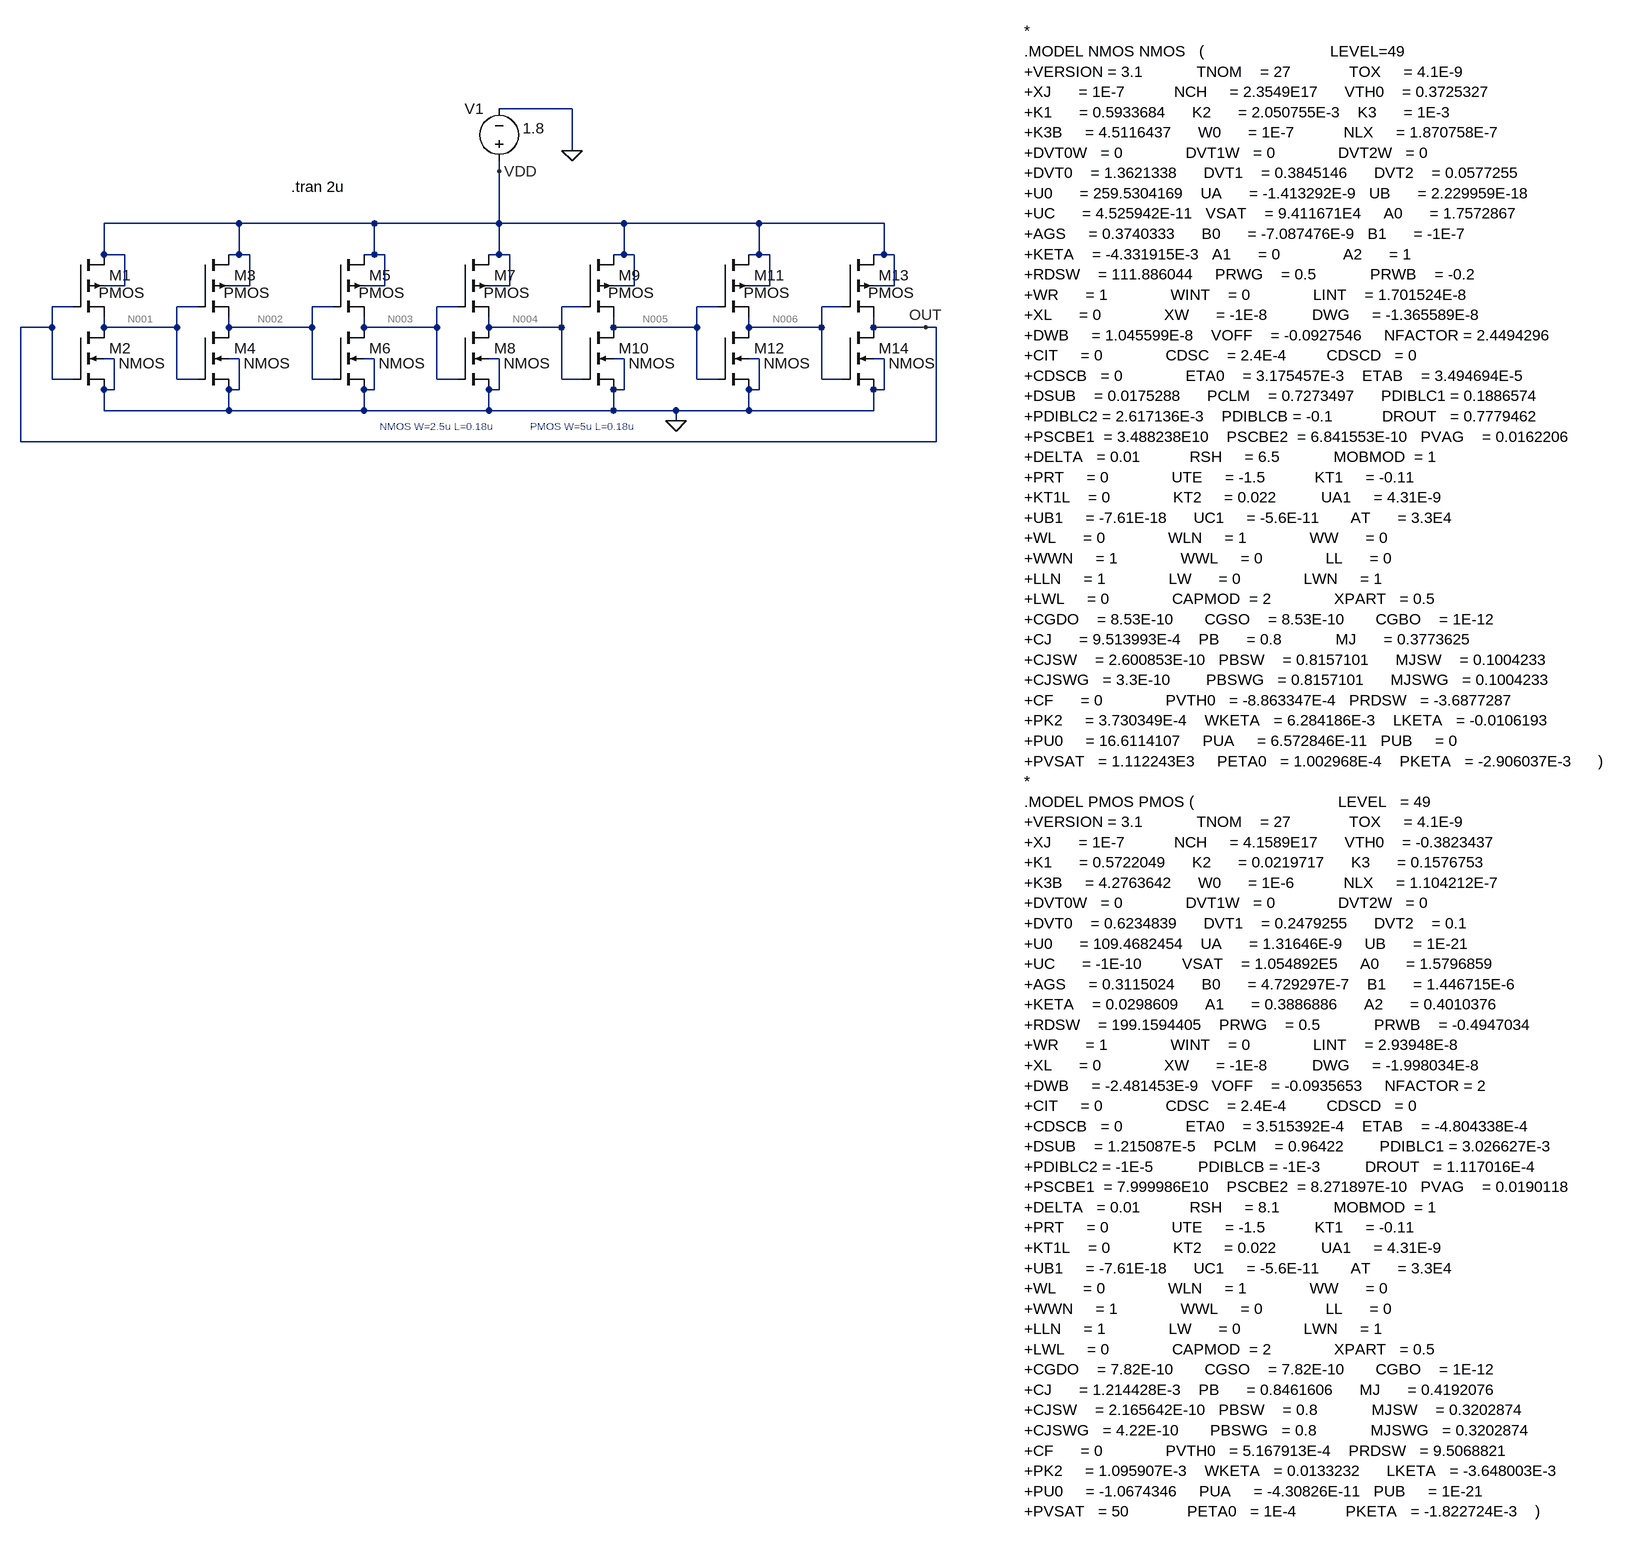
[diagram p0: schematic EXP3.asc]
EXP3.asc, the LTspice schematic file:
Version 4
SHEET 1 2600 1700
WIRE 960 -240 848 -240
WIRE 960 -176 960 -240
WIRE 848 -144 848 -160
WIRE 448 -64 240 -64
WIRE 656 -64 448 -64
WIRE 848 -64 848 -144
WIRE 848 -64 656 -64
WIRE 1040 -64 848 -64
WIRE 1248 -64 1040 -64
WIRE 1440 -64 1248 -64
WIRE 240 -16 240 -64
WIRE 272 -16 240 -16
WIRE 448 -16 448 -64
WIRE 448 -16 432 -16
WIRE 464 -16 448 -16
WIRE 656 -16 656 -64
WIRE 656 -16 640 -16
WIRE 672 -16 656 -16
WIRE 848 -16 848 -64
WIRE 848 -16 832 -16
WIRE 864 -16 848 -16
WIRE 1040 -16 1040 -64
WIRE 1040 -16 1024 -16
WIRE 1056 -16 1040 -16
WIRE 1248 -16 1248 -64
WIRE 1248 -16 1232 -16
WIRE 1264 -16 1248 -16
WIRE 1440 -16 1440 -64
WIRE 1440 -16 1424 -16
WIRE 1456 -16 1440 -16
WIRE 272 32 272 -16
WIRE 272 32 240 32
WIRE 464 32 464 -16
WIRE 464 32 432 32
WIRE 672 32 672 -16
WIRE 672 32 640 32
WIRE 864 32 864 -16
WIRE 864 32 832 32
WIRE 1056 32 1056 -16
WIRE 1056 32 1024 32
WIRE 1264 32 1264 -16
WIRE 1264 32 1232 32
WIRE 1456 32 1456 -16
WIRE 1456 32 1424 32
WIRE 192 64 160 64
WIRE 384 64 352 64
WIRE 592 64 560 64
WIRE 784 64 752 64
WIRE 976 64 944 64
WIRE 1184 64 1152 64
WIRE 1376 64 1344 64
WIRE 160 96 160 64
WIRE 160 96 112 96
WIRE 240 96 240 80
WIRE 352 96 352 64
WIRE 352 96 240 96
WIRE 432 96 432 80
WIRE 560 96 560 64
WIRE 560 96 432 96
WIRE 640 96 640 80
WIRE 752 96 752 64
WIRE 752 96 640 96
WIRE 832 96 832 80
WIRE 944 96 944 64
WIRE 944 96 832 96
WIRE 1024 96 1024 80
WIRE 1152 96 1152 64
WIRE 1152 96 1024 96
WIRE 1232 96 1232 80
WIRE 1344 96 1344 64
WIRE 1344 96 1232 96
WIRE 1424 96 1424 80
WIRE 1504 96 1424 96
WIRE 1520 96 1504 96
WIRE 256 144 240 144
WIRE 448 144 432 144
WIRE 656 144 640 144
WIRE 848 144 832 144
WIRE 1040 144 1024 144
WIRE 1248 144 1232 144
WIRE 1440 144 1424 144
WIRE 160 176 160 96
WIRE 192 176 160 176
WIRE 352 176 352 96
WIRE 384 176 352 176
WIRE 560 176 560 96
WIRE 592 176 560 176
WIRE 752 176 752 96
WIRE 784 176 752 176
WIRE 944 176 944 96
WIRE 976 176 944 176
WIRE 1152 176 1152 96
WIRE 1184 176 1152 176
WIRE 1344 176 1344 96
WIRE 1376 176 1344 176
WIRE 256 192 256 144
WIRE 256 192 240 192
WIRE 448 192 448 144
WIRE 448 192 432 192
WIRE 656 192 656 144
WIRE 656 192 640 192
WIRE 848 192 848 144
WIRE 848 192 832 192
WIRE 1040 192 1040 144
WIRE 1040 192 1024 192
WIRE 1248 192 1248 144
WIRE 1248 192 1232 192
WIRE 1440 192 1440 144
WIRE 1440 192 1424 192
WIRE 240 224 240 192
WIRE 432 224 432 192
WIRE 432 224 240 224
WIRE 640 224 640 192
WIRE 640 224 432 224
WIRE 832 224 832 192
WIRE 832 224 640 224
WIRE 1024 224 1024 192
WIRE 1024 224 832 224
WIRE 1120 224 1024 224
WIRE 1232 224 1232 192
WIRE 1232 224 1120 224
WIRE 1424 224 1424 192
WIRE 1424 224 1232 224
WIRE 1120 240 1120 224
WIRE 112 272 112 96
WIRE 1520 272 1520 96
WIRE 1520 272 112 272
FLAG 960 -176 0
FLAG 848 -144 VDD
FLAG 1504 96 OUT
FLAG 1120 240 0
SYMBOL pmos4 192 -16 R0
WINDOW 3 40 59 Left 2
SYMATTR InstName M1
SYMATTR Value2 l=0.18u w=5u
SYMBOL nmos4 192 96 R0
WINDOW 3 71 55 Left 2
SYMATTR InstName M2
SYMATTR Value2 l=0.18u w=2.5u
SYMBOL voltage 848 -144 R180
WINDOW 0 24 96 Left 2
WINDOW 3 -70 66 Left 2
WINDOW 123 0 0 Left 0
WINDOW 39 0 0 Left 0
SYMATTR InstName V1
SYMATTR Value 1.8
SYMBOL pmos4 384 -16 R0
WINDOW 3 40 59 Left 2
SYMATTR InstName M3
SYMATTR Value2 l=0.18u w=5u
SYMBOL nmos4 384 96 R0
WINDOW 3 71 55 Left 2
SYMATTR InstName M4
SYMATTR Value2 l=0.18u w=2.5u
SYMBOL pmos4 592 -16 R0
WINDOW 3 40 59 Left 2
SYMATTR InstName M5
SYMATTR Value2 l=0.18u w=5u
SYMBOL nmos4 592 96 R0
WINDOW 3 71 55 Left 2
SYMATTR InstName M6
SYMATTR Value2 l=0.18u w=2.5u
SYMBOL pmos4 784 -16 R0
WINDOW 3 40 59 Left 2
SYMATTR InstName M7
SYMATTR Value2 l=0.18u w=5u
SYMBOL nmos4 784 96 R0
WINDOW 3 71 55 Left 2
SYMATTR InstName M8
SYMATTR Value2 l=0.18u w=2.5u
SYMBOL pmos4 976 -16 R0
WINDOW 3 40 59 Left 2
SYMATTR InstName M9
SYMATTR Value2 l=0.18u w=5u
SYMBOL nmos4 976 96 R0
WINDOW 3 71 55 Left 2
SYMATTR InstName M10
SYMATTR Value2 l=0.18u w=2.5u
SYMBOL pmos4 1184 -16 R0
WINDOW 3 40 59 Left 2
SYMATTR InstName M11
SYMATTR Value2 l=0.18u w=5u
SYMBOL nmos4 1184 96 R0
WINDOW 3 71 55 Left 2
SYMATTR InstName M12
SYMATTR Value2 l=0.18u w=2.5u
SYMBOL pmos4 1376 -16 R0
WINDOW 3 40 59 Left 2
SYMATTR InstName M13
SYMATTR Value2 l=0.18u w=5u
SYMBOL nmos4 1376 96 R0
WINDOW 3 71 55 Left 2
SYMATTR InstName M14
SYMATTR Value2 l=0.18u w=2.5u
TEXT 896 248 Left 1 ;PMOS W=5u L=0.18u
TEXT 664 248 Left 1 ;NMOS W=2.5u L=0.18u
TEXT 528 -120 Left 2 !.tran 2u
TEXT 1656 -360 Left 2 !*\n.MODEL NMOS NMOS   (                            LEVEL=49\n+VERSION = 3.1            TNOM    = 27             TOX     = 4.1E-9\n+XJ      = 1E-7           NCH     = 2.3549E17      VTH0    = 0.3725327\n+K1      = 0.5933684      K2      = 2.050755E-3    K3      = 1E-3\n+K3B     = 4.5116437      W0      = 1E-7           NLX     = 1.870758E-7\n+DVT0W   = 0              DVT1W   = 0              DVT2W   = 0\n+DVT0    = 1.3621338      DVT1    = 0.3845146      DVT2    = 0.0577255\n+U0      = 259.5304169    UA      = -1.413292E-9   UB      = 2.229959E-18\n+UC      = 4.525942E-11   VSAT    = 9.411671E4     A0      = 1.7572867\n+AGS     = 0.3740333      B0      = -7.087476E-9   B1      = -1E-7\n+KETA    = -4.331915E-3   A1      = 0              A2      = 1\n+RDSW    = 111.886044     PRWG    = 0.5            PRWB    = -0.2\n+WR      = 1              WINT    = 0              LINT    = 1.701524E-8\n+XL      = 0              XW      = -1E-8          DWG     = -1.365589E-8\n+DWB     = 1.045599E-8    VOFF    = -0.0927546     NFACTOR = 2.4494296\n+CIT     = 0              CDSC    = 2.4E-4         CDSCD   = 0\n+CDSCB   = 0              ETA0    = 3.175457E-3    ETAB    = 3.494694E-5\n+DSUB    = 0.0175288      PCLM    = 0.7273497      PDIBLC1 = 0.1886574\n+PDIBLC2 = 2.617136E-3    PDIBLCB = -0.1           DROUT   = 0.7779462\n+PSCBE1  = 3.488238E10    PSCBE2  = 6.841553E-10   PVAG    = 0.0162206\n+DELTA   = 0.01           RSH     = 6.5            MOBMOD  = 1\n+PRT     = 0              UTE     = -1.5           KT1     = -0.11\n+KT1L    = 0              KT2     = 0.022          UA1     = 4.31E-9\n+UB1     = -7.61E-18      UC1     = -5.6E-11       AT      = 3.3E4\n+WL      = 0              WLN     = 1              WW      = 0\n+WWN     = 1              WWL     = 0              LL      = 0\n+LLN     = 1              LW      = 0              LWN     = 1\n+LWL     = 0              CAPMOD  = 2              XPART   = 0.5\n+CGDO    = 8.53E-10       CGSO    = 8.53E-10       CGBO    = 1E-12\n+CJ      = 9.513993E-4    PB      = 0.8            MJ      = 0.3773625\n+CJSW    = 2.600853E-10   PBSW    = 0.8157101      MJSW    = 0.1004233\n+CJSWG   = 3.3E-10        PBSWG   = 0.8157101      MJSWG   = 0.1004233\n+CF      = 0              PVTH0   = -8.863347E-4   PRDSW   = -3.6877287\n+PK2     = 3.730349E-4    WKETA   = 6.284186E-3    LKETA   = -0.0106193\n+PU0     = 16.6114107     PUA     = 6.572846E-11   PUB     = 0\n+PVSAT   = 1.112243E3     PETA0   = 1.002968E-4    PKETA   = -2.906037E-3      )\n*\n.MODEL PMOS PMOS (                                LEVEL   = 49\n+VERSION = 3.1            TNOM    = 27             TOX     = 4.1E-9\n+XJ      = 1E-7           NCH     = 4.1589E17      VTH0    = -0.3823437\n+K1      = 0.5722049      K2      = 0.0219717      K3      = 0.1576753\n+K3B     = 4.2763642      W0      = 1E-6           NLX     = 1.104212E-7\n+DVT0W   = 0              DVT1W   = 0              DVT2W   = 0\n+DVT0    = 0.6234839      DVT1    = 0.2479255      DVT2    = 0.1\n+U0      = 109.4682454    UA      = 1.31646E-9     UB      = 1E-21\n+UC      = -1E-10         VSAT    = 1.054892E5     A0      = 1.5796859\n+AGS     = 0.3115024      B0      = 4.729297E-7    B1      = 1.446715E-6\n+KETA    = 0.0298609      A1      = 0.3886886      A2      = 0.4010376\n+RDSW    = 199.1594405    PRWG    = 0.5            PRWB    = -0.4947034\n+WR      = 1              WINT    = 0              LINT    = 2.93948E-8\n+XL      = 0              XW      = -1E-8          DWG     = -1.998034E-8\n+DWB     = -2.481453E-9   VOFF    = -0.0935653     NFACTOR = 2\n+CIT     = 0              CDSC    = 2.4E-4         CDSCD   = 0\n+CDSCB   = 0              ETA0    = 3.515392E-4    ETAB    = -4.804338E-4\n+DSUB    = 1.215087E-5    PCLM    = 0.96422        PDIBLC1 = 3.026627E-3\n+PDIBLC2 = -1E-5          PDIBLCB = -1E-3          DROUT   = 1.117016E-4\n+PSCBE1  = 7.999986E10    PSCBE2  = 8.271897E-10   PVAG    = 0.0190118\n+DELTA   = 0.01           RSH     = 8.1            MOBMOD  = 1\n+PRT     = 0              UTE     = -1.5           KT1     = -0.11\n+KT1L    = 0              KT2     = 0.022          UA1     = 4.31E-9\n+UB1     = -7.61E-18      UC1     = -5.6E-11       AT      = 3.3E4\n+WL      = 0              WLN     = 1              WW      = 0\n+WWN     = 1              WWL     = 0              LL      = 0\n+LLN     = 1              LW      = 0              LWN     = 1\n+LWL     = 0              CAPMOD  = 2              XPART   = 0.5\n+CGDO    = 7.82E-10       CGSO    = 7.82E-10       CGBO    = 1E-12\n+CJ      = 1.214428E-3    PB      = 0.8461606      MJ      = 0.4192076\n+CJSW    = 2.165642E-10   PBSW    = 0.8            MJSW    = 0.3202874\n+CJSWG   = 4.22E-10       PBSWG   = 0.8            MJSWG   = 0.3202874\n+CF      = 0              PVTH0   = 5.167913E-4    PRDSW   = 9.5068821\n+PK2     = 1.095907E-3    WKETA   = 0.0133232      LKETA   = -3.648003E-3\n+PU0     = -1.0674346     PUA     = -4.30826E-11   PUB     = 1E-21\n+PVSAT   = 50             PETA0   = 1E-4           PKETA   = -1.822724E-3    )

The netlist it stands for:
* EXP3.asc
M1 VDD OUT N001 VDD PMOS l=0.18u w=5u
M2 N001 OUT 0 0 NMOS l=0.18u w=2.5u
V1 VDD 0 1.8
M3 VDD N001 N002 VDD PMOS l=0.18u w=5u
M4 N002 N001 0 0 NMOS l=0.18u w=2.5u
M5 VDD N002 N003 VDD PMOS l=0.18u w=5u
M6 N003 N002 0 0 NMOS l=0.18u w=2.5u
M7 VDD N003 N004 VDD PMOS l=0.18u w=5u
M8 N004 N003 0 0 NMOS l=0.18u w=2.5u
M9 VDD N004 N005 VDD PMOS l=0.18u w=5u
M10 N005 N004 0 0 NMOS l=0.18u w=2.5u
M11 VDD N005 N006 VDD PMOS l=0.18u w=5u
M12 N006 N005 0 0 NMOS l=0.18u w=2.5u
M13 VDD N006 OUT VDD PMOS l=0.18u w=5u
M14 OUT N006 0 0 NMOS l=0.18u w=2.5u
.model NMOS NMOS
.model PMOS PMOS
.lib standard.mos
* PMOS W=5u L=0.18u
* NMOS W=2.5u L=0.18u
.tran 2u
*
.MODEL NMOS NMOS   (                            LEVEL=49
+VERSION = 3.1            TNOM    = 27             TOX     = 4.1E-9
+XJ      = 1E-7           NCH     = 2.3549E17      VTH0    = 0.3725327
+K1      = 0.5933684      K2      = 2.050755E-3    K3      = 1E-3
+K3B     = 4.5116437      W0      = 1E-7           NLX     = 1.870758E-7
+DVT0W   = 0              DVT1W   = 0              DVT2W   = 0
+DVT0    = 1.3621338      DVT1    = 0.3845146      DVT2    = 0.0577255
+U0      = 259.5304169    UA      = -1.413292E-9   UB      = 2.229959E-18
+UC      = 4.525942E-11   VSAT    = 9.411671E4     A0      = 1.7572867
+AGS     = 0.3740333      B0      = -7.087476E-9   B1      = -1E-7
+KETA    = -4.331915E-3   A1      = 0              A2      = 1
+RDSW    = 111.886044     PRWG    = 0.5            PRWB    = -0.2
+WR      = 1              WINT    = 0              LINT    = 1.701524E-8
+XL      = 0              XW      = -1E-8          DWG     = -1.365589E-8
+DWB     = 1.045599E-8    VOFF    = -0.0927546     NFACTOR = 2.4494296
+CIT     = 0              CDSC    = 2.4E-4         CDSCD   = 0
+CDSCB   = 0              ETA0    = 3.175457E-3    ETAB    = 3.494694E-5
+DSUB    = 0.0175288      PCLM    = 0.7273497      PDIBLC1 = 0.1886574
+PDIBLC2 = 2.617136E-3    PDIBLCB = -0.1           DROUT   = 0.7779462
+PSCBE1  = 3.488238E10    PSCBE2  = 6.841553E-10   PVAG    = 0.0162206
+DELTA   = 0.01           RSH     = 6.5            MOBMOD  = 1
+PRT     = 0              UTE     = -1.5           KT1     = -0.11
+KT1L    = 0              KT2     = 0.022          UA1     = 4.31E-9
+UB1     = -7.61E-18      UC1     = -5.6E-11       AT      = 3.3E4
+WL      = 0              WLN     = 1              WW      = 0
+WWN     = 1              WWL     = 0              LL      = 0
+LLN     = 1              LW      = 0              LWN     = 1
+LWL     = 0              CAPMOD  = 2              XPART   = 0.5
+CGDO    = 8.53E-10       CGSO    = 8.53E-10       CGBO    = 1E-12
+CJ      = 9.513993E-4    PB      = 0.8            MJ      = 0.3773625
+CJSW    = 2.600853E-10   PBSW    = 0.8157101      MJSW    = 0.1004233
+CJSWG   = 3.3E-10        PBSWG   = 0.8157101      MJSWG   = 0.1004233
+CF      = 0              PVTH0   = -8.863347E-4   PRDSW   = -3.6877287
+PK2     = 3.730349E-4    WKETA   = 6.284186E-3    LKETA   = -0.0106193
+PU0     = 16.6114107     PUA     = 6.572846E-11   PUB     = 0
+PVSAT   = 1.112243E3     PETA0   = 1.002968E-4    PKETA   = -2.906037E-3      )
*
.MODEL PMOS PMOS (                                LEVEL   = 49
+VERSION = 3.1            TNOM    = 27             TOX     = 4.1E-9
+XJ      = 1E-7           NCH     = 4.1589E17      VTH0    = -0.3823437
+K1      = 0.5722049      K2      = 0.0219717      K3      = 0.1576753
+K3B     = 4.2763642      W0      = 1E-6           NLX     = 1.104212E-7
+DVT0W   = 0              DVT1W   = 0              DVT2W   = 0
+DVT0    = 0.6234839      DVT1    = 0.2479255      DVT2    = 0.1
+U0      = 109.4682454    UA      = 1.31646E-9     UB      = 1E-21
+UC      = -1E-10         VSAT    = 1.054892E5     A0      = 1.5796859
+AGS     = 0.3115024      B0      = 4.729297E-7    B1      = 1.446715E-6
+KETA    = 0.0298609      A1      = 0.3886886      A2      = 0.4010376
+RDSW    = 199.1594405    PRWG    = 0.5            PRWB    = -0.4947034
+WR      = 1              WINT    = 0              LINT    = 2.93948E-8
+XL      = 0              XW      = -1E-8          DWG     = -1.998034E-8
+DWB     = -2.481453E-9   VOFF    = -0.0935653     NFACTOR = 2
+CIT     = 0              CDSC    = 2.4E-4         CDSCD   = 0
+CDSCB   = 0              ETA0    = 3.515392E-4    ETAB    = -4.804338E-4
+DSUB    = 1.215087E-5    PCLM    = 0.96422        PDIBLC1 = 3.026627E-3
+PDIBLC2 = -1E-5          PDIBLCB = -1E-3          DROUT   = 1.117016E-4
+PSCBE1  = 7.999986E10    PSCBE2  = 8.271897E-10   PVAG    = 0.0190118
+DELTA   = 0.01           RSH     = 8.1            MOBMOD  = 1
+PRT     = 0              UTE     = -1.5           KT1     = -0.11
+KT1L    = 0              KT2     = 0.022          UA1     = 4.31E-9
+UB1     = -7.61E-18      UC1     = -5.6E-11       AT      = 3.3E4
+WL      = 0              WLN     = 1              WW      = 0
+WWN     = 1              WWL     = 0              LL      = 0
+LLN     = 1              LW      = 0              LWN     = 1
+LWL     = 0              CAPMOD  = 2              XPART   = 0.5
+CGDO    = 7.82E-10       CGSO    = 7.82E-10       CGBO    = 1E-12
+CJ      = 1.214428E-3    PB      = 0.8461606      MJ      = 0.4192076
+CJSW    = 2.165642E-10   PBSW    = 0.8            MJSW    = 0.3202874
+CJSWG   = 4.22E-10       PBSWG   = 0.8            MJSWG   = 0.3202874
+CF      = 0              PVTH0   = 5.167913E-4    PRDSW   = 9.5068821
+PK2     = 1.095907E-3    WKETA   = 0.0133232      LKETA   = -3.648003E-3
+PU0     = -1.0674346     PUA     = -4.30826E-11   PUB     = 1E-21
+PVSAT   = 50             PETA0   = 1E-4           PKETA   = -1.822724E-3    )
.backanno
.end

* Results of the author's LTspice run, read from the files saved beside the schematic
* Operating Point, zero values left out:
*   V(vdd) = 1.8 V
*   V(out) = 860.6 mV
*   V(n001) = 860.6 mV
*   V(n002) = 860.6 mV
*   V(n003) = 860.6 mV
*   V(n004) = 860.6 mV
*   V(n005) = 860.6 mV
*   V(n006) = 860.6 mV
*   Id(M14) = 242.6 µA
*   Is(M14) = -242.6 µA
*   Id(M12) = 242.6 µA
*   Is(M12) = -242.6 µA
*   Id(M10) = 242.6 µA
*   Is(M10) = -242.6 µA
*   Id(M8) = 242.6 µA
*   Is(M8) = -242.6 µA
*   Id(M6) = 242.6 µA
*   Is(M6) = -242.6 µA
*   Id(M4) = 242.6 µA
*   Is(M4) = -242.6 µA
*   Id(M2) = 242.6 µA
*   Is(M2) = -242.6 µA
*   Id(M13) = 242.6 µA
*   Is(M13) = -242.6 µA
*   Id(M11) = 242.6 µA
*   Is(M11) = -242.6 µA
*   Id(M9) = 242.6 µA
*   Is(M9) = -242.6 µA
*   Id(M7) = 242.6 µA
*   Is(M7) = -242.6 µA
*   Id(M5) = 242.6 µA
*   Is(M5) = -242.6 µA
*   Id(M3) = 242.6 µA
*   Is(M3) = -242.6 µA
*   Id(M1) = 242.6 µA
*   Is(M1) = -242.6 µA
*   I(V1) = -1.698 mA